# EasyEDA schematic SCH_v0.1_2021-01-27.json

## Sheets
1 CPU CORE: TITLE: CPU Core; REV: 0.1; Date: 2020-07-01; Sheet: 1/3; Drawn By: Renee; Company: Lost Cat Productions
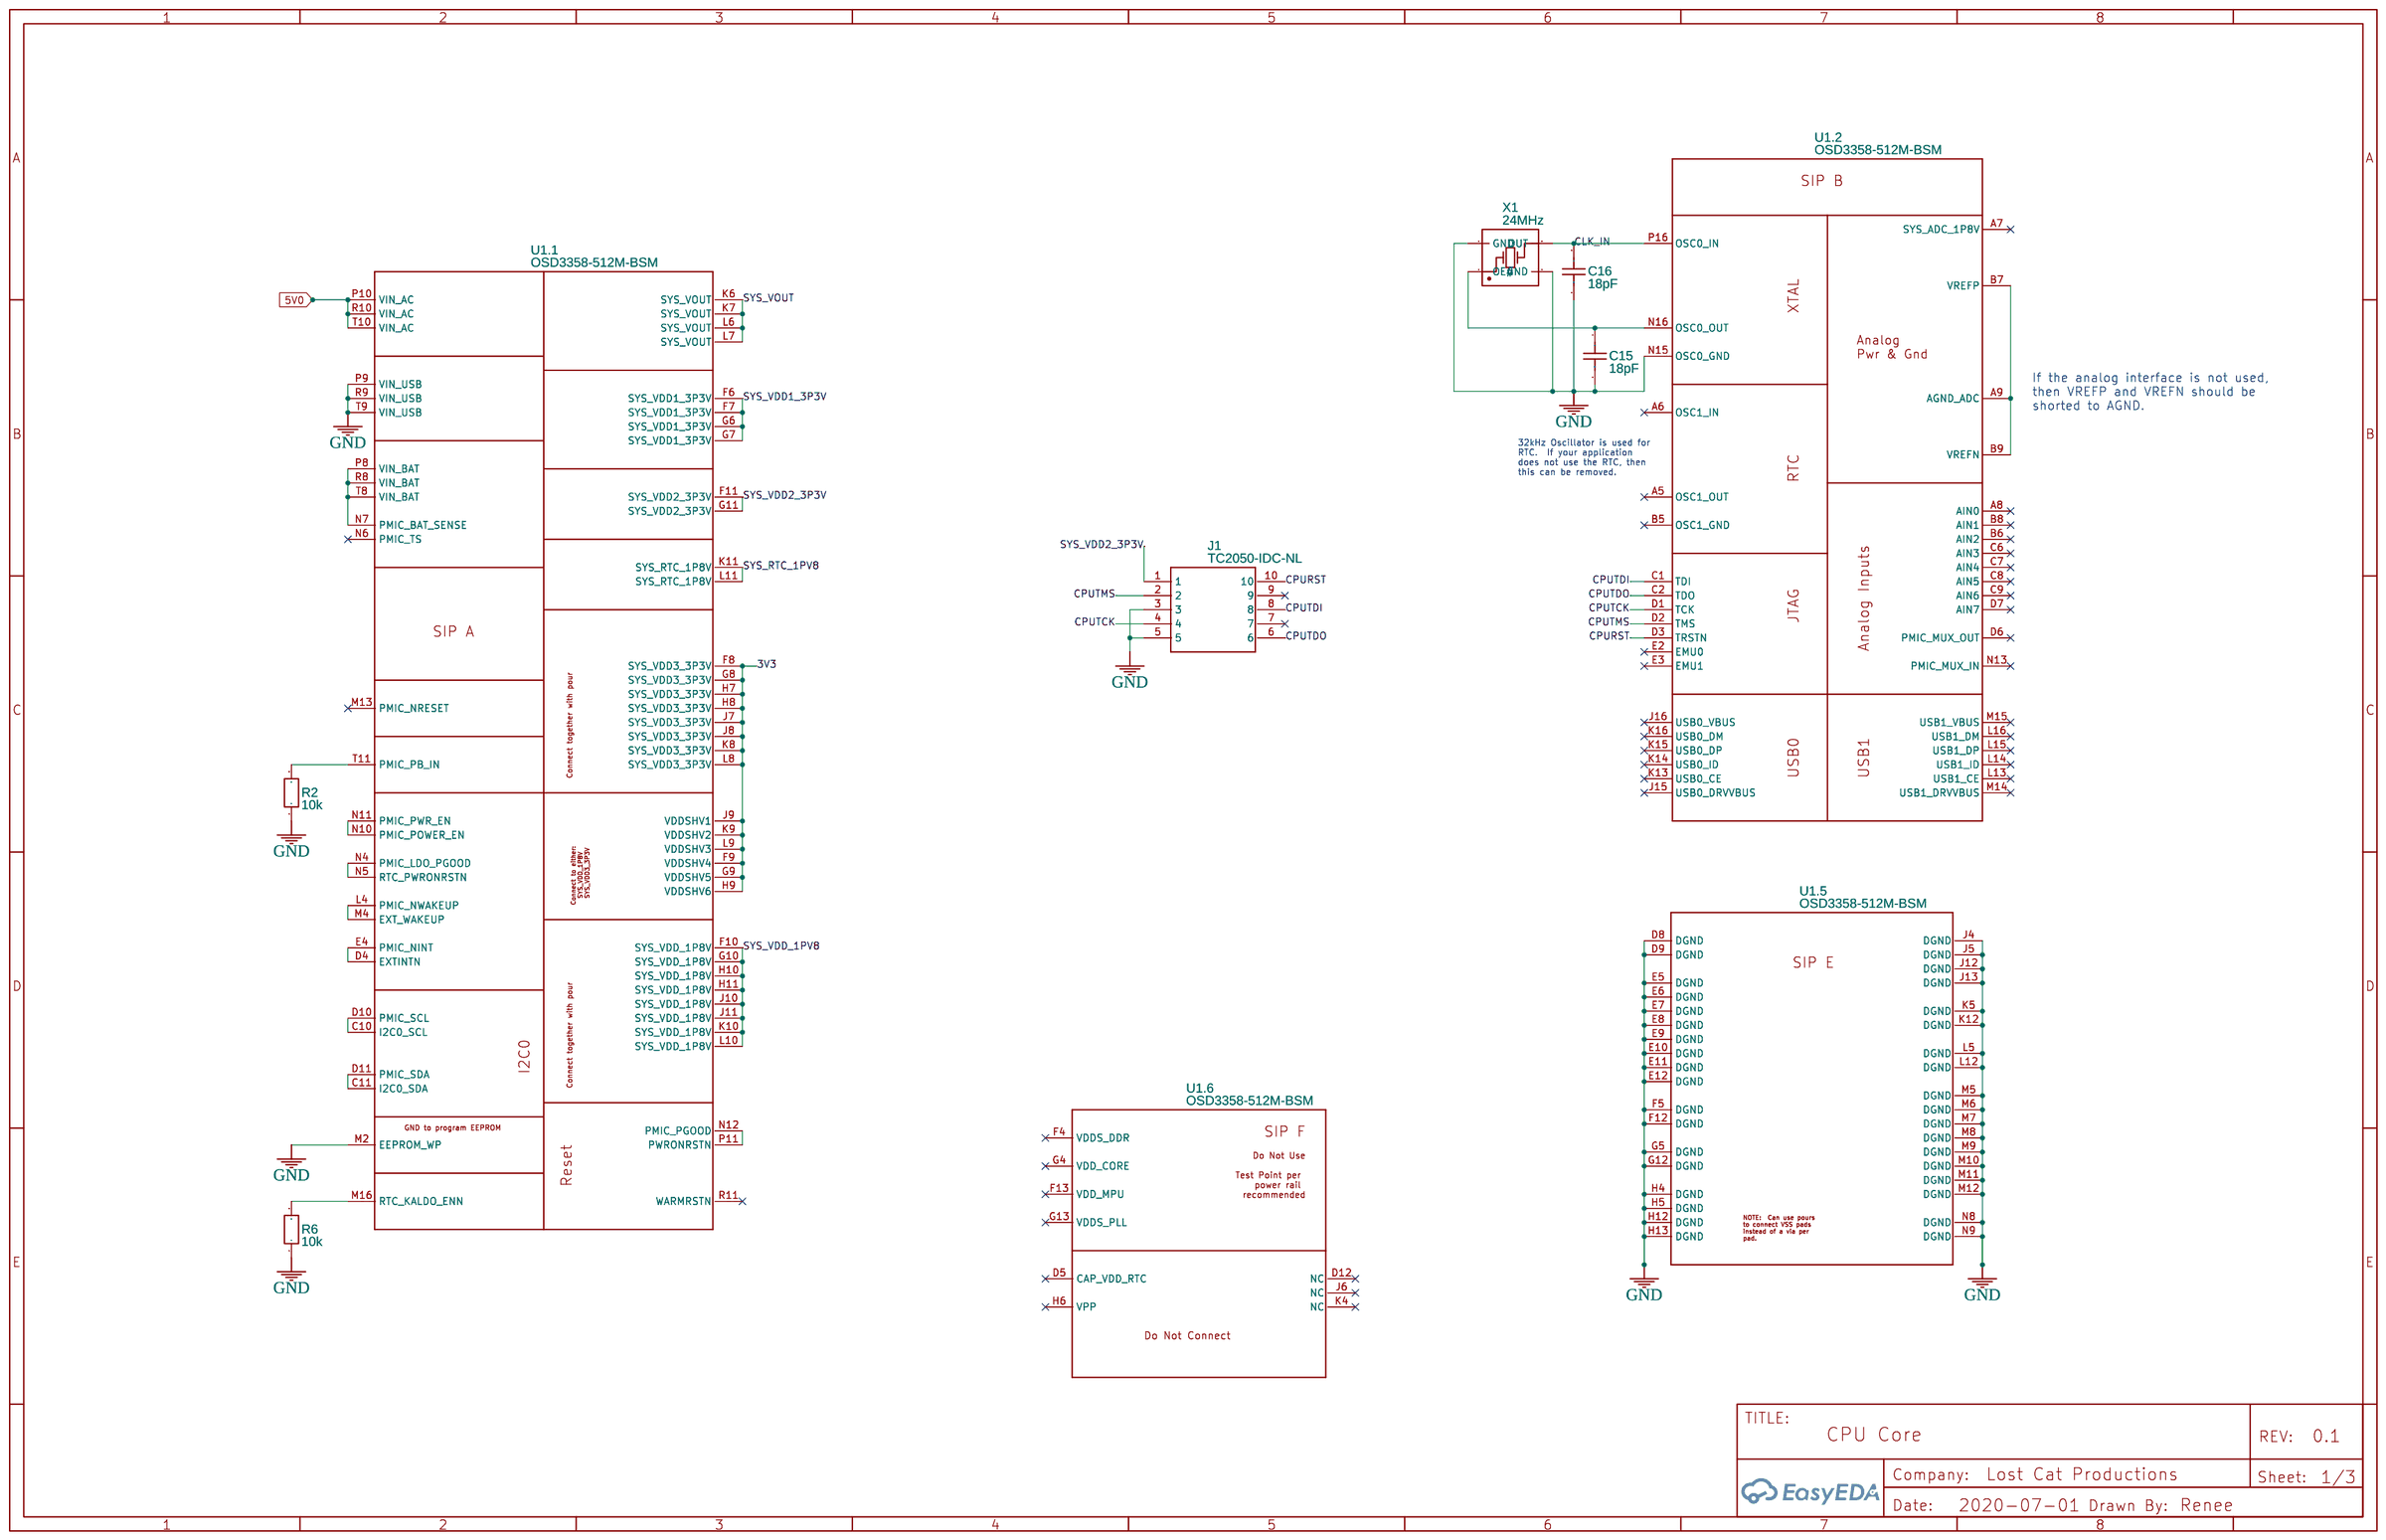
[diagram p0: CPU CORE]
2 CPU IO: TITLE: CPU Interface; Date: 2020-08-06; Sheet: 2/3
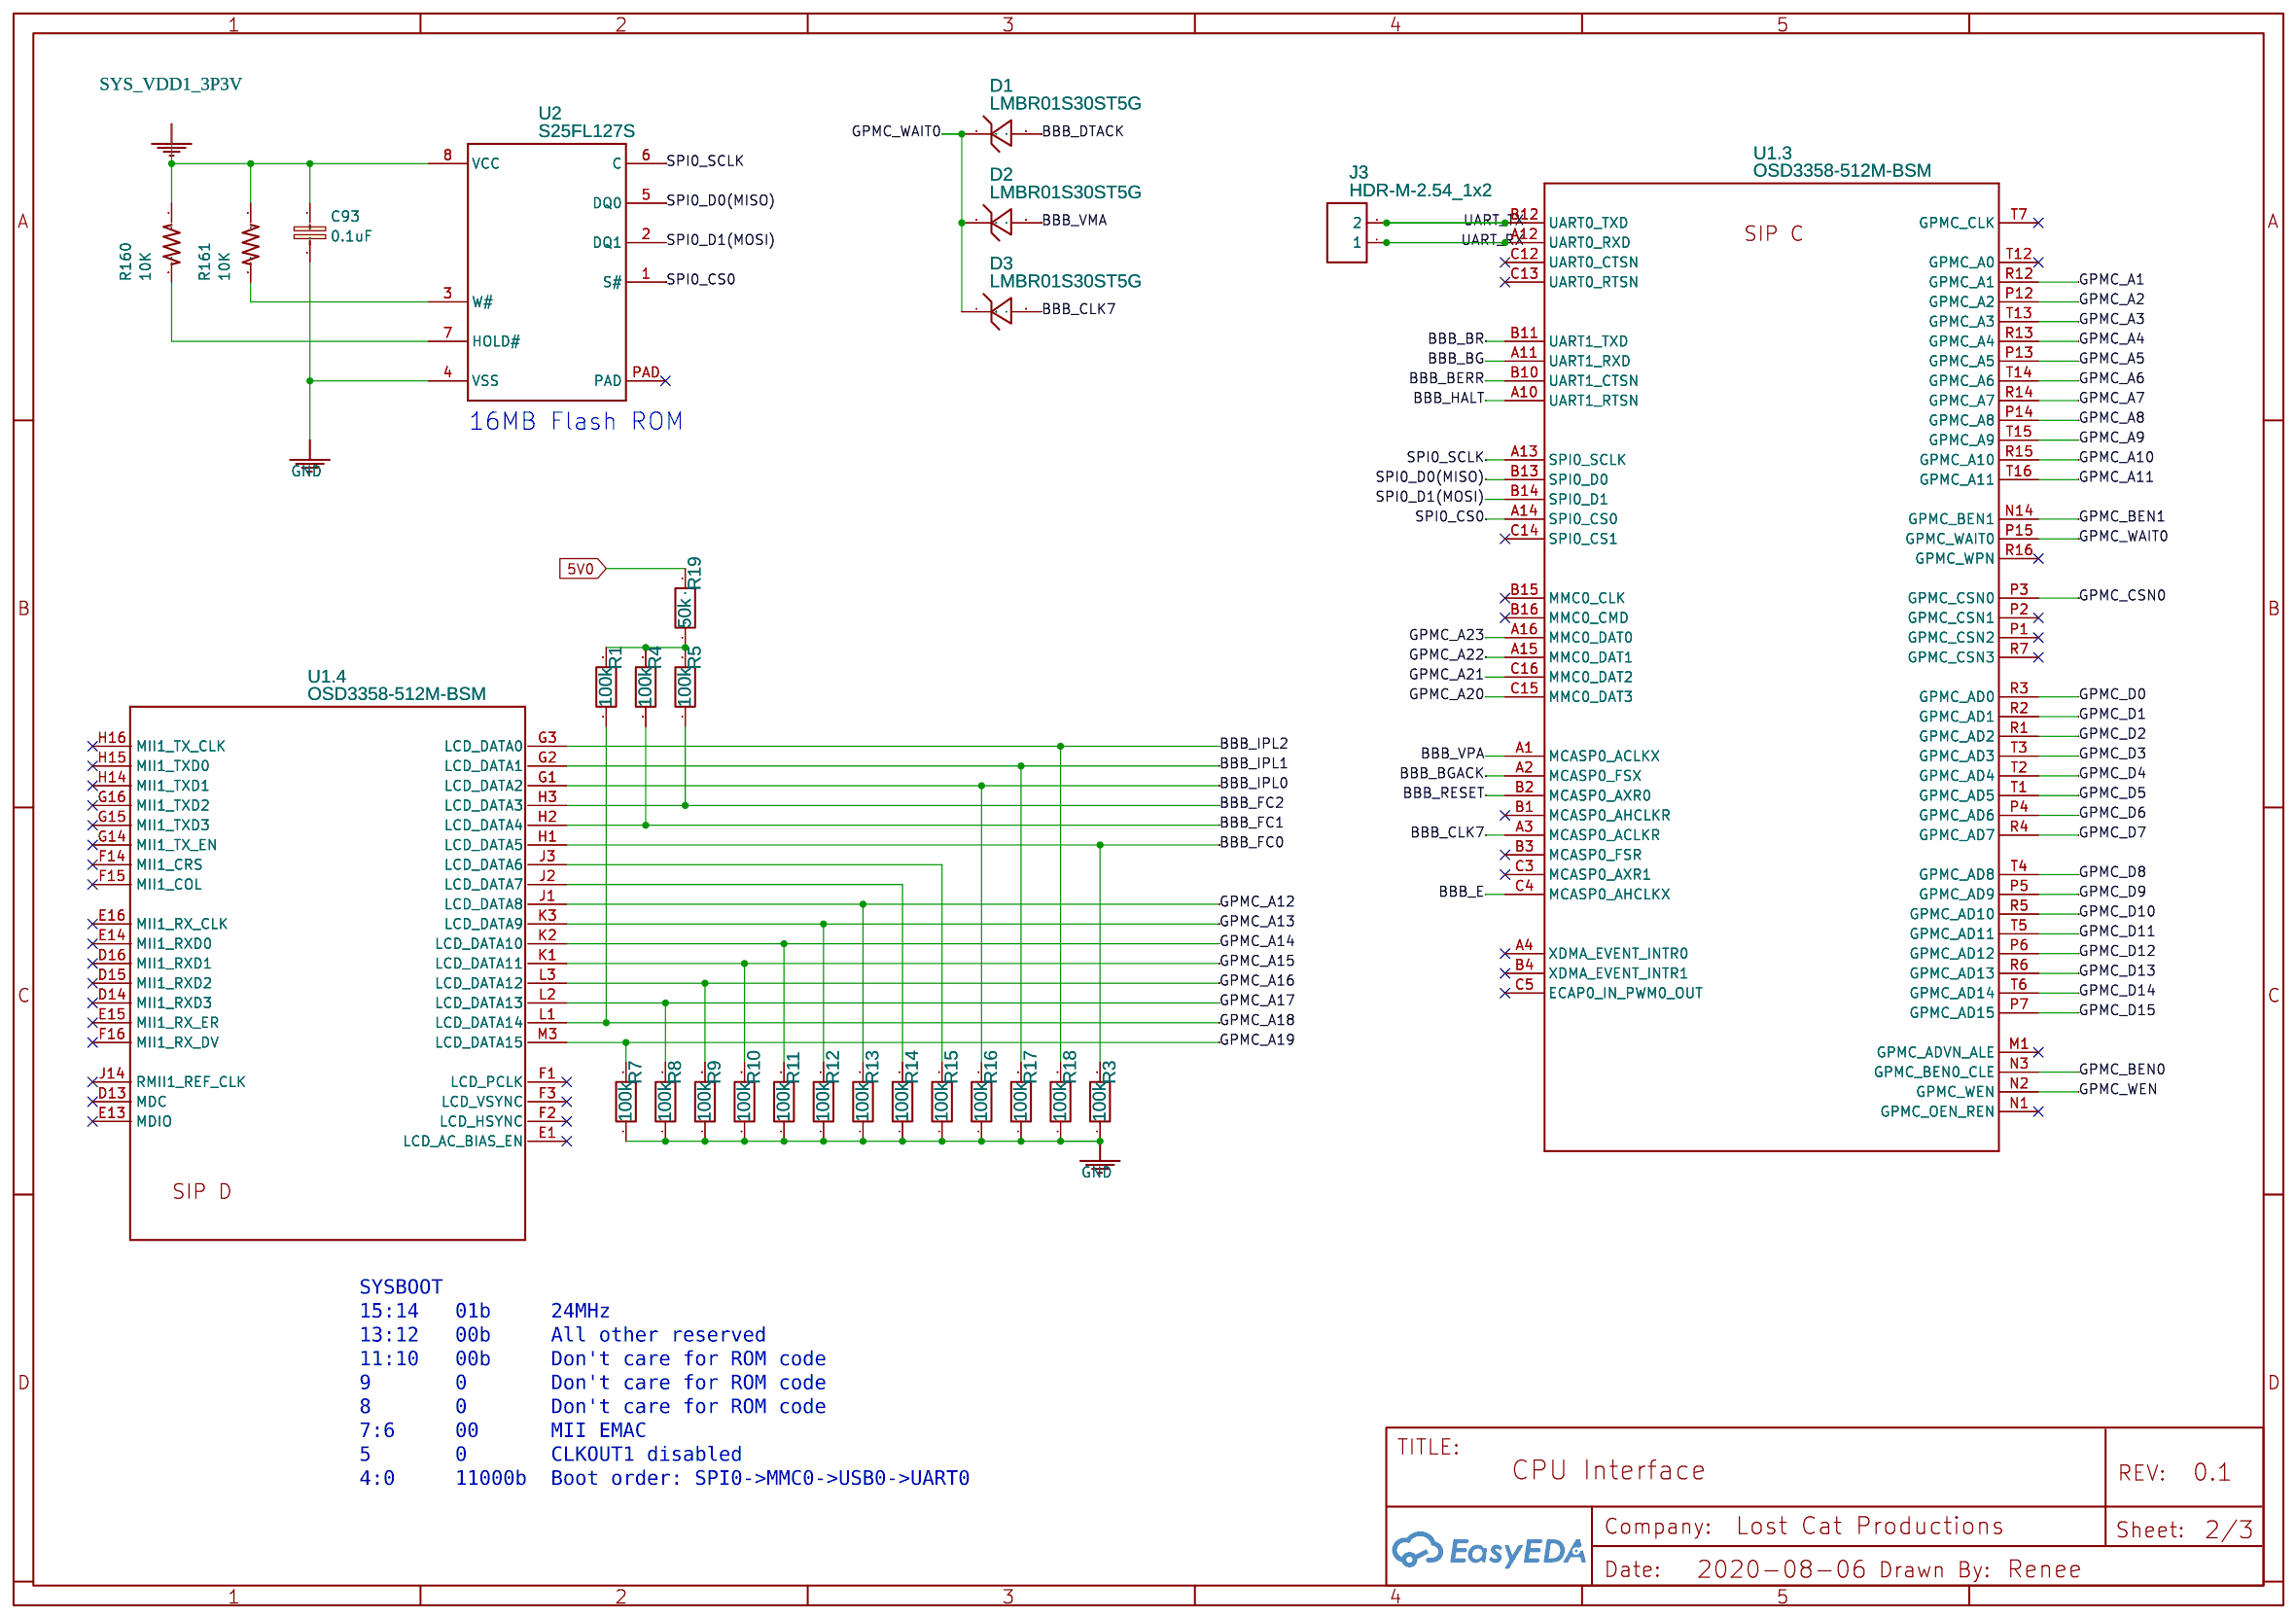
[diagram p1: CPU IO]
3 M68K IO: TITLE: M68K Interface; Sheet: 3/3
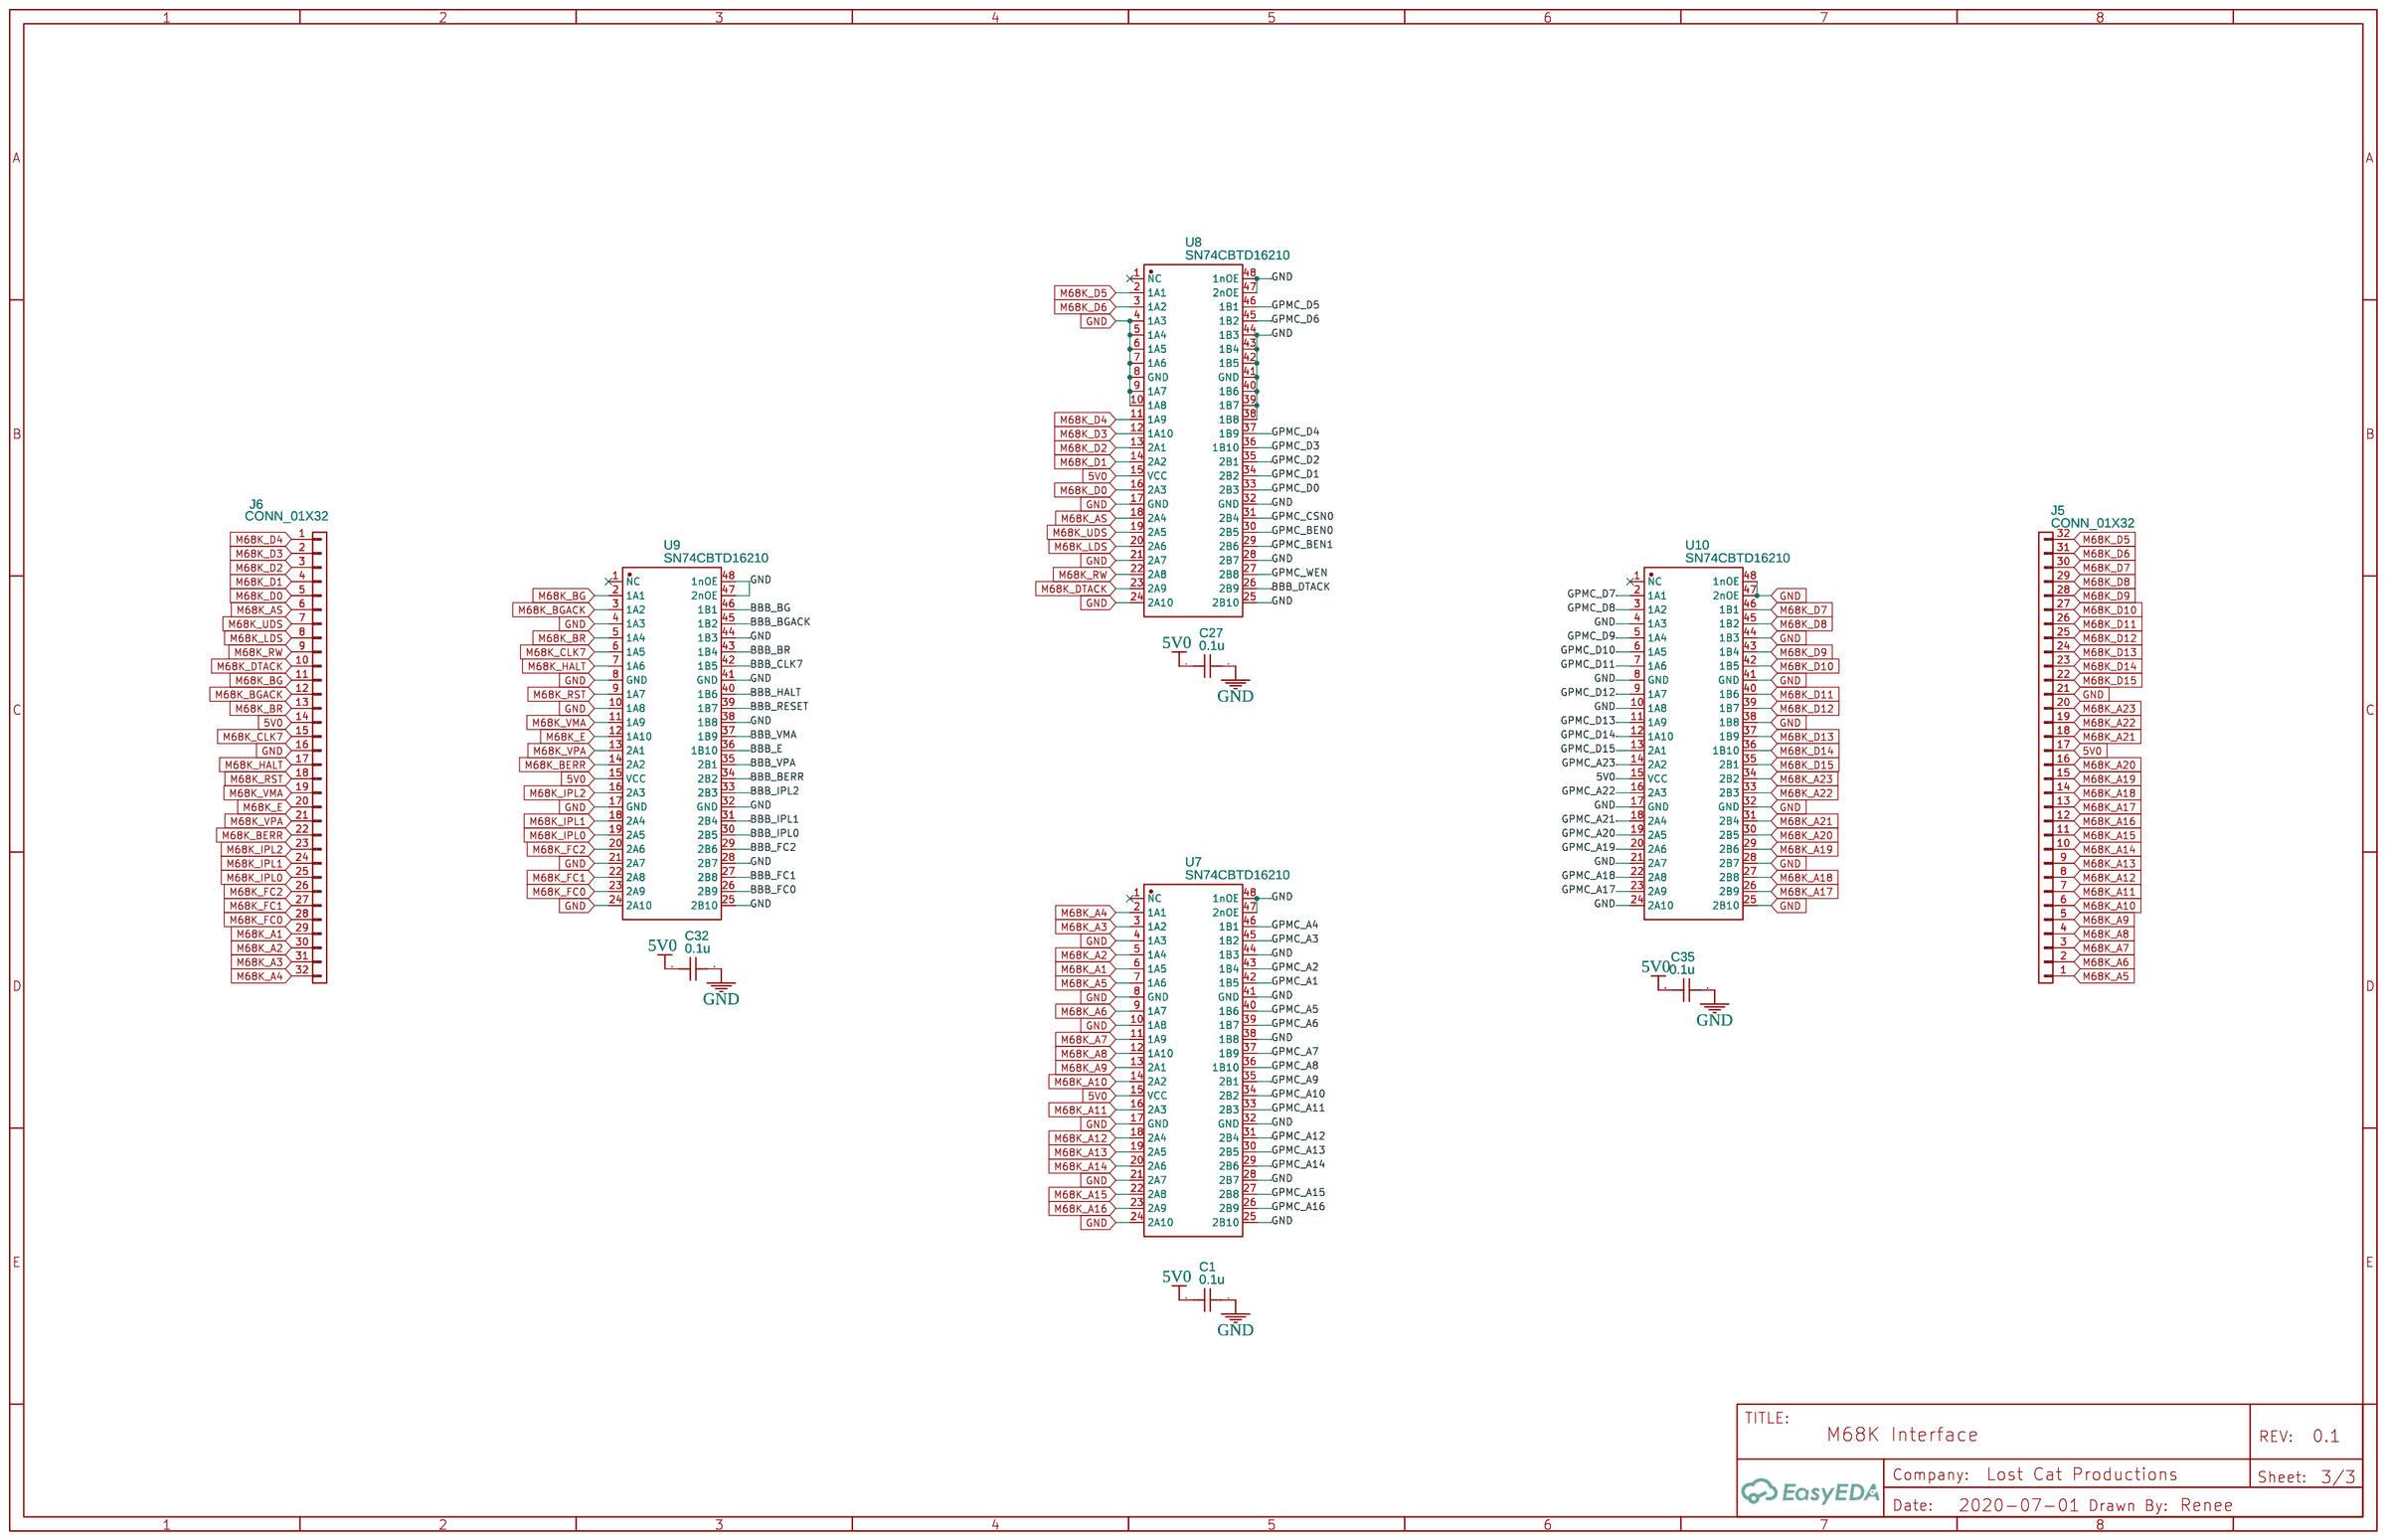
[diagram p2: M68K IO]

## Parts
sheet CPU CORE
C15  18pF  [C0201]
C16  18pF  [C0201]
J1  TC2050-IDC-NL  [TAG-CONNECT_TC2050-IDC-NL]
R2  10k  [R0201]
R6  10k  [R0201]
U1  OSD3358-512M-BSM  [OSD335X-BGA-256]  (sections 1,2,3,4,5,6)
X1  24MHz  [OSC-SMD_4P-L1.6-W1.2-BL]
sheet CPU IO
C93  0.1uF  [C0402]
D1  LMBR01S30ST5G  [X3-DFN0603-2_L0.6-W0.3-RD]
D2  LMBR01S30ST5G  [X3-DFN0603-2_L0.6-W0.3-RD]
D3  LMBR01S30ST5G  [X3-DFN0603-2_L0.6-W0.3-RD]
J3  HDR-M-2.54_1x2  [HDR-M-2.54_1X2]
R1  100k  [R0201]
R3  100k  [R0201]
R4  100k  [R0201]
R5  100k  [R0201]
R7  100k  [R0201]
R8  100k  [R0201]
R9  100k  [R0201]
R10  100k  [R0201]
R11  100k  [R0201]
R12  100k  [R0201]
R13  100k  [R0201]
R14  100k  [R0201]
R15  100k  [R0201]
R16  100k  [R0201]
R17  100k  [R0201]
R18  100k  [R0201]
R19  50k  [R0201]
R160  10K  [R0402]
R161  10K  [R0402]
U2  S25FL127S  [W-PDFN-8]
sheet M68K IO
C1  0.1u  [C0402]
C27  0.1u  [C0402]
C32  0.1u  [C0402]
C35  0.1u  [C0402]
J5  CONN_01X32  [PIN_HEADER_STRAIGHT_1X32_PITCH2.54MM]
J6  CONN_01X32  [PIN_HEADER_STRAIGHT_1X32_PITCH2.54MM]
U7  SN74CBTD16210  [TSSOP-48]
U8  SN74CBTD16210  [TSSOP-48]
U9  SN74CBTD16210  [TSSOP-48]
U10  SN74CBTD16210  [TSSOP-48]

## Library data of the parts
C15 C16 = C_0201_US: Supplier Part: C307443; Supplier: LCSC; Contributor: LCEDA_Lib; Manufacturer Part: CL05C180JB5NNNC; Manufacturer: Samsung Electro-Mechanics
J1 = TC2050-IDC-NL: Contributor: Joar Gjersund
R2 R6 = R_0201_EU: Supplier Part: C92037; Supplier: LCSC; Contributor: LCEDA_Lib; Manufacturer Part: NTCG063JF103FTB; Manufacturer: TDK
U1 = OSD3358-512M-BSM: Contributor: Renee; subpart_no: 1
X1 = NX1612SA-24MHZ-STD-CIS-1: Supplier: LCSC; Supplier Part: C280834; Manufacturer: Nihon Dempa Kogyo; Contributor: LCSC
C93 = -: Supplier: LCSC; Manufacturer: SAMSUNG; Manufacturer Part: CL05B104KO5NNNC; Supplier Part: C1525
D1-D3 = LMBR01S30ST5G: Supplier: LCSC; Supplier Part: C383224; Manufacturer: Leshan Radio; Contributor: LCSC
J3 = HDR-M-2.54_1x2: Supplier Part: C124375; Supplier: LCSC; Contributor: LCEDA_Lib
R1 R3-R5 R7-R19 = R_0201_EU: Contributor: LCEDA_Lib
R160 R161 = -: Supplier: LCSC; Manufacturer: TDK; Manufacturer Part: NTCG104BH103JT1; Supplier Part: C92039
U2 = S25FL127S: Contributor: Renee; Manufacturer Part: S25FL127SABMFI103; Supplier: LCSC; Manufacturer: Cypress Semicon; Supplier Part: C511143
C1 C27 C32 C35 = C_0402_US: Supplier Part: C1525; Supplier: LCSC; Contributor: LCEDA_Lib; Manufacturer Part: CL05B104KO5NNNC; Manufacturer: SAMSUNG
J5 J6 = -: Contributor: KiCAD; license: https://www.gnu.org/licenses/lgpl-2.1.html; Manufacturer Part: ?
U7-U10 = SN74CBTD16210

## Nets
3V3: U1.F8(SYS_VDD3_3P3V) U1.F9(VDDSHV4) U1.G8(SYS_VDD3_3P3V) U1.G9(VDDSHV5) U1.H7(SYS_VDD3_3P3V) U1.H8(SYS_VDD3_3P3V) U1.H9(VDDSHV6) U1.J7(SYS_VDD3_3P3V) U1.J8(SYS_VDD3_3P3V) U1.J9(VDDSHV1) U1.K8(SYS_VDD3_3P3V) U1.K9(VDDSHV2) U1.L8(SYS_VDD3_3P3V) U1.L9(VDDSHV3)
5V0: C1.1 C27.1 C32.1 C35.2 J5.17(P17) J6.14(P14) R19.2 U1.P10(VIN_AC) U1.R10(VIN_AC) U1.T10(VIN_AC) U7.15(VCC) U8.15(VCC) U9.15(VCC) U10.15(VCC)
GND: C1.2 C15.2 C16.1 C27.2 C32.2 C35.1 C93.2 J1.3 J1.5 J5.21(P21) J6.16(P16) R2.1 R3.1 R6.1 R7.1 R8.1 R9.1 R10.1 R11.1 R12.1 R13.1 R14.1 R15.1 R16.1 R17.1 R18.1 U1.D8(DGND) U1.D9(DGND) U1.E5(DGND) U1.E6(DGND) U1.E7(DGND) U1.E8(DGND) U1.E9(DGND) U1.E10(DGND) U1.E11(DGND) U1.E12(DGND) U1.F5(DGND) U1.F12(DGND) U1.G5(DGND) U1.G12(DGND) U1.H4(DGND) U1.H5(DGND) U1.H12(DGND) U1.H13(DGND) U1.J4(DGND) U1.J5(DGND) U1.J12(DGND) U1.J13(DGND) U1.K5(DGND) U1.K12(DGND) U1.L5(DGND) U1.L12(DGND) U1.M2(EEPROM_WP) U1.M5(DGND) U1.M6(DGND) U1.M7(DGND) U1.M8(DGND) U1.M9(DGND) U1.M10(DGND) U1.M11(DGND) U1.M12(DGND) U1.N8(DGND) U1.N9(DGND) U1.N15(OSC0_GND) U1.P9(VIN_USB) U1.R9(VIN_USB) U1.T9(VIN_USB) U2.4(VSS) U7.4(1A3) U7.8(GND) U7.10(1A8) U7.17(GND) U7.21(2A7) U7.24(2A10) U7.25(2B10) U7.28(2B7) U7.32(GND) U7.38(1B8) U7.41(GND) U7.44(1B3) U7.47(2nOE) U7.48(1nOE) U8.4(1A3) U8.5(1A4) U8.6(1A5) U8.7(1A6) U8.8(GND) U8.9(1A7) U8.10(1A8) U8.17(GND) U8.21(2A7) U8.24(2A10) U8.25(2B10) U8.28(2B7) U8.32(GND) U8.38(1B8) U8.39(1B7) U8.40(1B6) U8.41(GND) U8.42(1B5) U8.43(1B4) U8.44(1B3) U8.47(2nOE) U8.48(1nOE) U9.4(1A3) U9.8(GND) U9.10(1A8) U9.17(GND) U9.21(2A7) U9.24(2A10) U9.25(2B10) U9.28(2B7) U9.32(GND) U9.38(1B8) U9.41(GND) U9.44(1B3) U9.47(2nOE) U9.48(1nOE) U10.4(1A3) U10.8(GND) U10.10(1A8) U10.17(GND) U10.21(2A7) U10.24(2A10) U10.25(2B10) U10.28(2B7) U10.32(GND) U10.38(1B8) U10.41(GND) U10.44(1B3) U10.47(2nOE) U10.48(1nOE) X1.2(GND) X1.4(GND)
BBB_BERR: U1.B10(UART1_CTSN) U9.34(2B2)
BBB_BG: U1.A11(UART1_RXD) U9.46(1B1)
BBB_BGACK: U1.A2(MCASP0_FSX) U9.45(1B2)
BBB_BR: U1.B11(UART1_TXD) U9.43(1B4)
BBB_CLK7: D3.2(A) U1.A3(MCASP0_ACLKR) U9.42(1B5)
BBB_DTACK: D1.2(A) U8.26(2B9)
BBB_E: U1.C4(MCASP0_AHCLKX) U9.36(1B10)
BBB_FC0: R3.2 U1.H1(LCD_DATA5) U9.26(2B9)
BBB_FC1: R4.1 U1.H2(LCD_DATA4) U9.27(2B8)
BBB_FC2: R5.1 U1.H3(LCD_DATA3) U9.29(2B6)
BBB_HALT: U1.A10(UART1_RTSN) U9.40(1B6)
BBB_IPL0: R16.2 U1.G1(LCD_DATA2) U9.30(2B5)
BBB_IPL1: R17.2 U1.G2(LCD_DATA1) U9.31(2B4)
BBB_IPL2: R18.2 U1.G3(LCD_DATA0) U9.33(2B3)
BBB_RESET: U1.B2(MCASP0_AXR0) U9.39(1B7)
BBB_VMA: D2.2(A) U9.37(1B9)
BBB_VPA: U1.A1(MCASP0_ACLKX) U9.35(2B1)
CLK_IN: C16.2 U1.P16(OSC0_IN) X1.3(OUT)
CPURST: J1.10 U1.D3(TRSTN)
CPUTCK: J1.4 U1.D1(TCK)
CPUTDI: J1.8 U1.C1(TDI)
CPUTDO: J1.6 U1.C2(TDO)
CPUTMS: J1.2 U1.D2(TMS)
GPMC_A1: U1.R12(GPMC_A1) U7.42(1B5)
GPMC_A2: U1.P12(GPMC_A2) U7.43(1B4)
GPMC_A3: U1.T13(GPMC_A3) U7.45(1B2)
GPMC_A4: U1.R13(GPMC_A4) U7.46(1B1)
GPMC_A5: U1.P13(GPMC_A5) U7.40(1B6)
GPMC_A6: U1.T14(GPMC_A6) U7.39(1B7)
GPMC_A7: U1.R14(GPMC_A7) U7.37(1B9)
GPMC_A8: U1.P14(GPMC_A8) U7.36(1B10)
GPMC_A9: U1.T15(GPMC_A9) U7.35(2B1)
GPMC_A10: U1.R15(GPMC_A10) U7.34(2B2)
GPMC_A11: U1.T16(GPMC_A11) U7.33(2B3)
GPMC_A12: R13.2 U1.J1(LCD_DATA8) U7.31(2B4)
GPMC_A13: R12.2 U1.K3(LCD_DATA9) U7.30(2B5)
GPMC_A14: R11.2 U1.K2(LCD_DATA10) U7.29(2B6)
GPMC_A15: R10.2 U1.K1(LCD_DATA11) U7.27(2B8)
GPMC_A16: R9.2 U1.L3(LCD_DATA12) U7.26(2B9)
GPMC_A17: R8.2 U1.L2(LCD_DATA13) U10.23(2A9)
GPMC_A18: R1.1 U1.L1(LCD_DATA14) U10.22(2A8)
GPMC_A19: R7.2 U1.M3(LCD_DATA15) U10.20(2A6)
GPMC_A20: U1.C15(MMC0_DAT3) U10.19(2A5)
GPMC_A21: U1.C16(MMC0_DAT2) U10.18(2A4)
GPMC_A22: U1.A15(MMC0_DAT1) U10.16(2A3)
GPMC_A23: U1.A16(MMC0_DAT0) U10.14(2A2)
GPMC_BEN0: U1.N3(GPMC_BEN0_CLE) U8.30(2B5)
GPMC_BEN1: U1.N14(GPMC_BEN1) U8.29(2B6)
GPMC_CSN0: U1.P3(GPMC_CSN0) U8.31(2B4)
GPMC_D0: U1.R3(GPMC_AD0) U8.33(2B3)
GPMC_D1: U1.R2(GPMC_AD1) U8.34(2B2)
GPMC_D2: U1.R1(GPMC_AD2) U8.35(2B1)
GPMC_D3: U1.T3(GPMC_AD3) U8.36(1B10)
GPMC_D4: U1.T2(GPMC_AD4) U8.37(1B9)
GPMC_D5: U1.T1(GPMC_AD5) U8.46(1B1)
GPMC_D6: U1.P4(GPMC_AD6) U8.45(1B2)
GPMC_D7: U1.R4(GPMC_AD7) U10.2(1A1)
GPMC_D8: U1.T4(GPMC_AD8) U10.3(1A2)
GPMC_D9: U1.P5(GPMC_AD9) U10.5(1A4)
GPMC_D10: U1.R5(GPMC_AD10) U10.6(1A5)
GPMC_D11: U1.T5(GPMC_AD11) U10.7(1A6)
GPMC_D12: U1.P6(GPMC_AD12) U10.9(1A7)
GPMC_D13: U1.R6(GPMC_AD13) U10.11(1A9)
GPMC_D14: U1.T6(GPMC_AD14) U10.12(1A10)
GPMC_D15: U1.P7(GPMC_AD15) U10.13(2A1)
GPMC_WAIT0: D1.1(C) D2.1(C) D3.1(C) U1.P15(GPMC_WAIT0)
GPMC_WEN: U1.N2(GPMC_WEN) U8.27(2B8)
M68K_A1: J6.29(P29) U7.6(1A5)
M68K_A2: J6.30(P30) U7.5(1A4)
M68K_A3: J6.31(P31) U7.3(1A2)
M68K_A4: J6.32(P32) U7.2(1A1)
M68K_A5: J5.1(P1) U7.7(1A6)
M68K_A6: J5.2(P2) U7.9(1A7)
M68K_A7: J5.3(P3) U7.11(1A9)
M68K_A8: J5.4(P4) U7.12(1A10)
M68K_A9: J5.5(P5) U7.13(2A1)
M68K_A10: J5.6(P6) U7.14(2A2)
M68K_A11: J5.7(P7) U7.16(2A3)
M68K_A12: J5.8(P8) U7.18(2A4)
M68K_A13: J5.9(P9) U7.19(2A5)
M68K_A14: J5.10(P10) U7.20(2A6)
M68K_A15: J5.11(P11) U7.22(2A8)
M68K_A16: J5.12(P12) U7.23(2A9)
M68K_A17: J5.13(P13) U10.26(2B9)
M68K_A18: J5.14(P14) U10.27(2B8)
M68K_A19: J5.15(P15) U10.29(2B6)
M68K_A20: J5.16(P16) U10.30(2B5)
M68K_A21: J5.18(P18) U10.31(2B4)
M68K_A22: J5.19(P19) U10.33(2B3)
M68K_A23: J5.20(P20) U10.34(2B2)
M68K_AS: J6.6(P6) U8.18(2A4)
M68K_BERR: J6.22(P22) U9.14(2A2)
M68K_BG: J6.11(P11) U9.2(1A1)
M68K_BGACK: J6.12(P12) U9.3(1A2)
M68K_BR: J6.13(P13) U9.5(1A4)
M68K_CLK7: J6.15(P15) U9.6(1A5)
M68K_D0: J6.5(P5) U8.16(2A3)
M68K_D1: J6.4(P4) U8.14(2A2)
M68K_D2: J6.3(P3) U8.13(2A1)
M68K_D3: J6.2(P2) U8.12(1A10)
M68K_D4: J6.1(P1) U8.11(1A9)
M68K_D5: J5.32(P32) U8.2(1A1)
M68K_D6: J5.31(P31) U8.3(1A2)
M68K_D7: J5.30(P30) U10.46(1B1)
M68K_D8: J5.29(P29) U10.45(1B2)
M68K_D9: J5.28(P28) U10.43(1B4)
M68K_D10: J5.27(P27) U10.42(1B5)
M68K_D11: J5.26(P26) U10.40(1B6)
M68K_D12: J5.25(P25) U10.39(1B7)
M68K_D13: J5.24(P24) U10.37(1B9)
M68K_D14: J5.23(P23) U10.36(1B10)
M68K_D15: J5.22(P22) U10.35(2B1)
M68K_DTACK: J6.10(P10) U8.23(2A9)
M68K_E: J6.20(P20) U9.12(1A10)
M68K_FC0: J6.28(P28) U9.23(2A9)
M68K_FC1: J6.27(P27) U9.22(2A8)
M68K_FC2: J6.26(P26) U9.20(2A6)
M68K_HALT: J6.17(P17) U9.7(1A6)
M68K_IPL0: J6.25(P25) U9.19(2A5)
M68K_IPL1: J6.24(P24) U9.18(2A4)
M68K_IPL2: J6.23(P23) U9.16(2A3)
M68K_LDS: J6.8(P8) U8.20(2A6)
M68K_RST: J6.18(P18) U9.9(1A7)
M68K_RW: J6.9(P9) U8.22(2A8)
M68K_UDS: J6.7(P7) U8.19(2A5)
M68K_VMA: J6.19(P19) U9.11(1A9)
M68K_VPA: J6.21(P21) U9.13(2A1)
SPI0_CS0: U1.A14(SPI0_CS0) U2.1(S#)
SPI0_D0(MISO): U1.B13(SPI0_D0) U2.5(DQ0)
SPI0_D1(MOSI): U1.B14(SPI0_D1) U2.2(DQ1)
SPI0_SCLK: U1.A13(SPI0_SCLK) U2.6(C)
SYS_RTC_1PV8: U1.K11(SYS_RTC_1P8V) U1.L11(SYS_RTC_1P8V)
SYS_VDD1_3P3V: C93.1 R160.1 R161.1 U1.F6(SYS_VDD1_3P3V) U1.F7(SYS_VDD1_3P3V) U1.G6(SYS_VDD1_3P3V) U1.G7(SYS_VDD1_3P3V) U2.8(VCC)
SYS_VDD2_3P3V: J1.1 U1.F11(SYS_VDD2_3P3V) U1.G11(SYS_VDD2_3P3V)
SYS_VDD_1PV8: U1.F10(SYS_VDD_1P8V) U1.G10(SYS_VDD_1P8V) U1.H10(SYS_VDD_1P8V) U1.H11(SYS_VDD_1P8V) U1.J10(SYS_VDD_1P8V) U1.J11(SYS_VDD_1P8V) U1.K10(SYS_VDD_1P8V) U1.L10(SYS_VDD_1P8V)
SYS_VOUT: U1.K6(SYS_VOUT) U1.K7(SYS_VOUT) U1.L6(SYS_VOUT) U1.L7(SYS_VOUT)
UART_RX: J3.1 U1.A12(UART0_RXD)
UART_TX: J3.2 U1.B12(UART0_TXD)
Net-(C15-1): C15.1 U1.N16(OSC0_OUT) X1.1(OE#)
Net-(R1-2): R1.2 R4.2 R5.2 R19.1
Net-(R2-2): R2.2 U1.T11(PMIC_PB_IN)
Net-(R6-2): R6.2 U1.M16(RTC_KALDO_ENN)
Net-(R14-2): R14.2 U1.J2(LCD_DATA7)
Net-(R15-2): R15.2 U1.J3(LCD_DATA6)
Net-(R160-2): R160.2 U2.7(HOLD#)
Net-(R161-2): R161.2 U2.3(W#)
Net-(U1.1-C10): U1.C10(I2C0_SCL) U1.D10(PMIC_SCL)
Net-(U1.1-C11): U1.C11(I2C0_SDA) U1.D11(PMIC_SDA)
Net-(U1.1-D4): U1.D4(EXTINTN) U1.E4(PMIC_NINT)
Net-(U1.1-L4): U1.L4(PMIC_NWAKEUP) U1.M4(EXT_WAKEUP)
Net-(U1.1-N4): U1.N4(PMIC_LDO_PGOOD) U1.N5(RTC_PWRONRSTN)
Net-(U1.1-N7): U1.N7(PMIC_BAT_SENSE) U1.P8(VIN_BAT) U1.R8(VIN_BAT) U1.T8(VIN_BAT)
Net-(U1.1-N10): U1.N10(PMIC_POWER_EN) U1.N11(PMIC_PWR_EN)
Net-(U1.1-N12): U1.N12(PMIC_PGOOD) U1.P11(PWRONRSTN)
Net-(U1.2-A9): U1.A9(AGND_ADC) U1.B7(VREFP) U1.B9(VREFN)

Not connected (* = marked no-connect by the designer): J1 7* 9*; U1 A4(XDMA_EVENT_INTR0)* A5(OSC1_OUT)* A6(OSC1_IN)* A7(SYS_ADC_1P8V)* A8(AIN0)* B1(MCASP0_AHCLKR)* B3(MCASP0_FSR)* B4(XDMA_EVENT_INTR1)* B5(OSC1_GND)* B6(AIN2)* B8(AIN1)* B15(MMC0_CLK)* B16(MMC0_CMD)* C3(MCASP0_AXR1)* C5(ECAP0_IN_PWM0_OUT)* C6(AIN3)* C7(AIN4)* C8(AIN5)* C9(AIN6)* C12(UART0_CTSN)* C13(UART0_RTSN)* C14(SPI0_CS1)* D5(CAP_VDD_RTC)* D6(PMIC_MUX_OUT)* D7(AIN7)* D12(NC)* D13(MDC)* D14(MII1_RXD3)* D15(MII1_RXD2)* D16(MII1_RXD1)* E1(LCD_AC_BIAS_EN)* E2(EMU0)* E3(EMU1)* E13(MDIO)* E14(MII1_RXD0)* E15(MII1_RX_ER)* E16(MII1_RX_CLK)* F1(LCD_PCLK)* F2(LCD_HSYNC)* F3(LCD_VSYNC)* F4(VDDS_DDR)* F13(VDD_MPU)* F14(MII1_CRS)* F15(MII1_COL)* F16(MII1_RX_DV)* G4(VDD_CORE)* G13(VDDS_PLL)* G14(MII1_TX_EN)* G15(MII1_TXD3)* G16(MII1_TXD2)* H6(VPP)* H14(MII1_TXD1)* H15(MII1_TXD0)* H16(MII1_TX_CLK)* J6(NC)* J14(RMII1_REF_CLK)* J15(USB0_DRVVBUS)* J16(USB0_VBUS)* K4(NC)* K13(USB0_CE)* K14(USB0_ID)* K15(USB0_DP)* K16(USB0_DM)* L13(USB1_CE)* L14(USB1_ID)* L15(USB1_DP)* L16(USB1_DM)* M1(GPMC_ADVN_ALE)* M13(PMIC_NRESET)* M14(USB1_DRVVBUS)* M15(USB1_VBUS)* N1(GPMC_OEN_REN)* N6(PMIC_TS)* N13(PMIC_MUX_IN)* P1(GPMC_CSN2)* P2(GPMC_CSN1)* R7(GPMC_CSN3)* R11(WARMRSTN)* R16(GPMC_WPN)* T7(GPMC_CLK)* T12(GPMC_A0)*; U2 PAD*; U7 1(NC)*; U8 1(NC)*; U9 1(NC)*; U10 1(NC)*

## Notes on the sheets
sheet 1
- If the analog interface is not used,
  then VREFP and VREFN should be
  shorted to AGND.
- 32kHz Oscillator is used for
  RTC.  If your application
  does not use the RTC, then
  this can be removed.
sheet 2
- 16MB Flash ROM
- SYSBOOT
  15:14   01b     24MHz
  13:12   00b     All other reserved
  11:10   00b     Don't care for ROM code
  9       0       Don't care for ROM code
  8       0       Don't care for ROM code
  7:6     00      MII EMAC
  5       0       CLKOUT1 disabled
  4:0     11000b  Boot order: SPI0->MMC0->USB0->UART0
